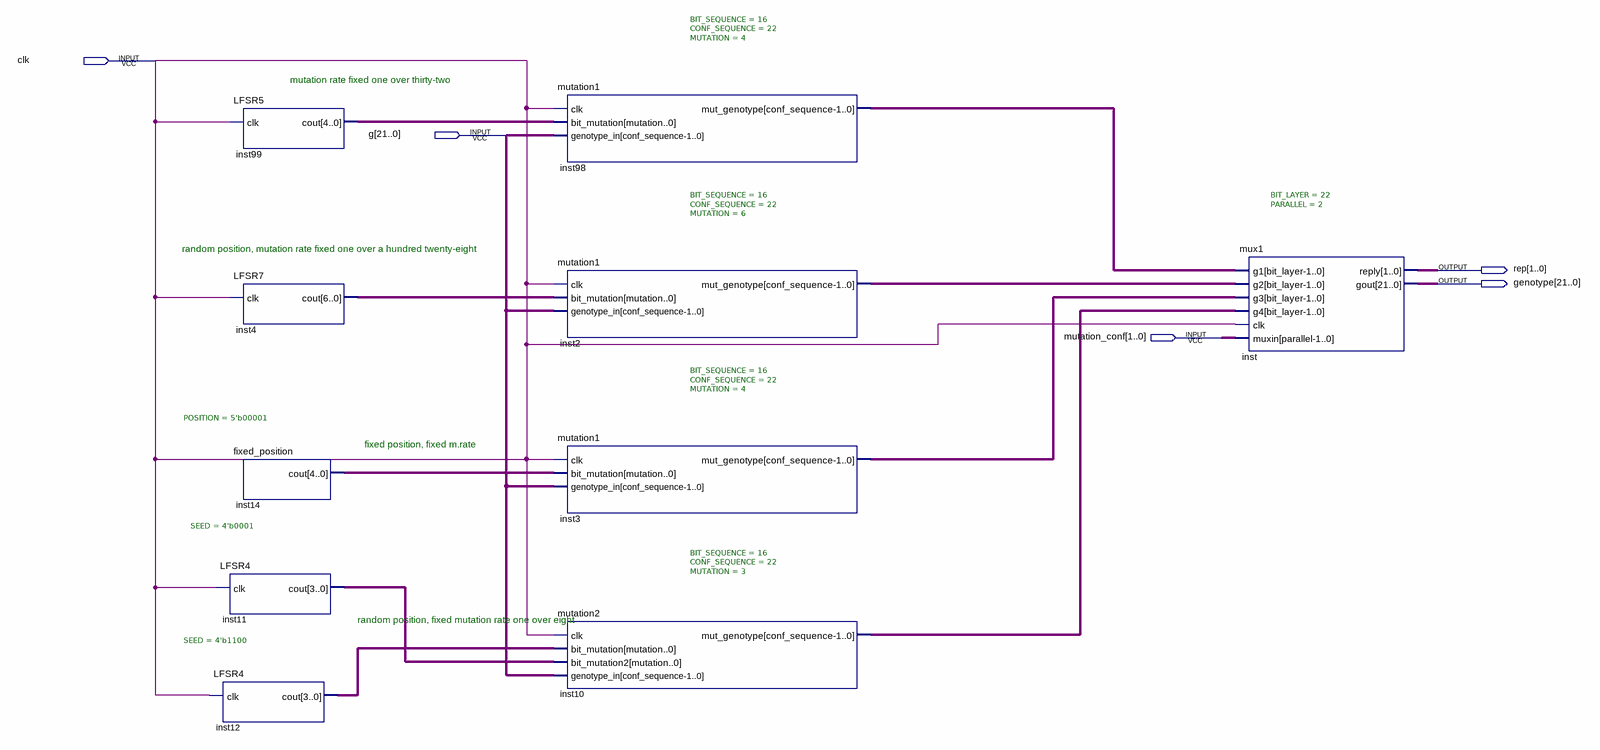
[diagram p0: schematic sheet]
// Quartus schematic evolvable_operator1.bdf as structural Verilog: 10 symbols, 5 pins
module evolvable_operator1 (
  input  clk,
  input  [21:0] g,
  input  [1:0] mutation_conf,
  output [1:0] rep,
  output [21:0] genotype
);

  wire [3:0] inst11_cout, inst12_cout;
  wire [4:0] inst14_cout, inst99_cout;
  wire [6:0] inst4_cout;
  wire [21:0] inst2_mut_genotype, inst3_mut_genotype, inst10_mut_genotype, inst98_mut_genotype;

  LFSR5 inst99 (.clk(clk), .cout(inst99_cout));
  LFSR7 inst4 (.clk(clk), .cout(inst4_cout));
  fixed_position #(.POSITION(5'b00001)) inst14 (.cout(inst14_cout));
  LFSR4 #(.SEED(4'b0001)) inst11 (.clk(clk), .cout(inst11_cout));
  LFSR4 #(.SEED(4'b1100)) inst12 (.clk(clk), .cout(inst12_cout));
  mutation1 #(.BIT_SEQUENCE(16), .CONF_SEQUENCE(22), .MUTATION(4)) inst98 (
    .clk(clk), .bit_mutation(inst99_cout), .genotype_in(g), .mut_genotype(inst98_mut_genotype));
  mutation1 #(.BIT_SEQUENCE(16), .CONF_SEQUENCE(22), .MUTATION(6)) inst2 (
    .clk(clk), .bit_mutation(inst4_cout), .genotype_in(g), .mut_genotype(inst2_mut_genotype));
  mutation1 #(.BIT_SEQUENCE(16), .CONF_SEQUENCE(22), .MUTATION(4)) inst3 (
    .clk(clk), .bit_mutation(inst14_cout), .genotype_in(g), .mut_genotype(inst3_mut_genotype));
  mutation2 #(.BIT_SEQUENCE(16), .CONF_SEQUENCE(22), .MUTATION(3)) inst10 (
    .clk(clk), .bit_mutation(inst12_cout), .bit_mutation2(inst11_cout), .genotype_in(g),
    .mut_genotype(inst10_mut_genotype));
  mux1 #(.BIT_LAYER(22), .PARALLEL(2)) inst (
    .g1(inst98_mut_genotype), .g2(inst2_mut_genotype), .g3(inst3_mut_genotype), .g4(inst10_mut_genotype),
    .clk(clk), .muxin(mutation_conf), .reply(rep), .gout(genotype));

  // Notes on the sheet:
  //   mutation rate fixed one over thirty-two
  //   random position, mutation rate fixed one over a hundred twenty-eight
  //   fixed position, fixed m.rate
  //   random position, fixed mutation rate one over eight
endmodule
